# EAGLE design MRCS-MorseKOB_Sounder_Driver (EAGLE 7.7.0)
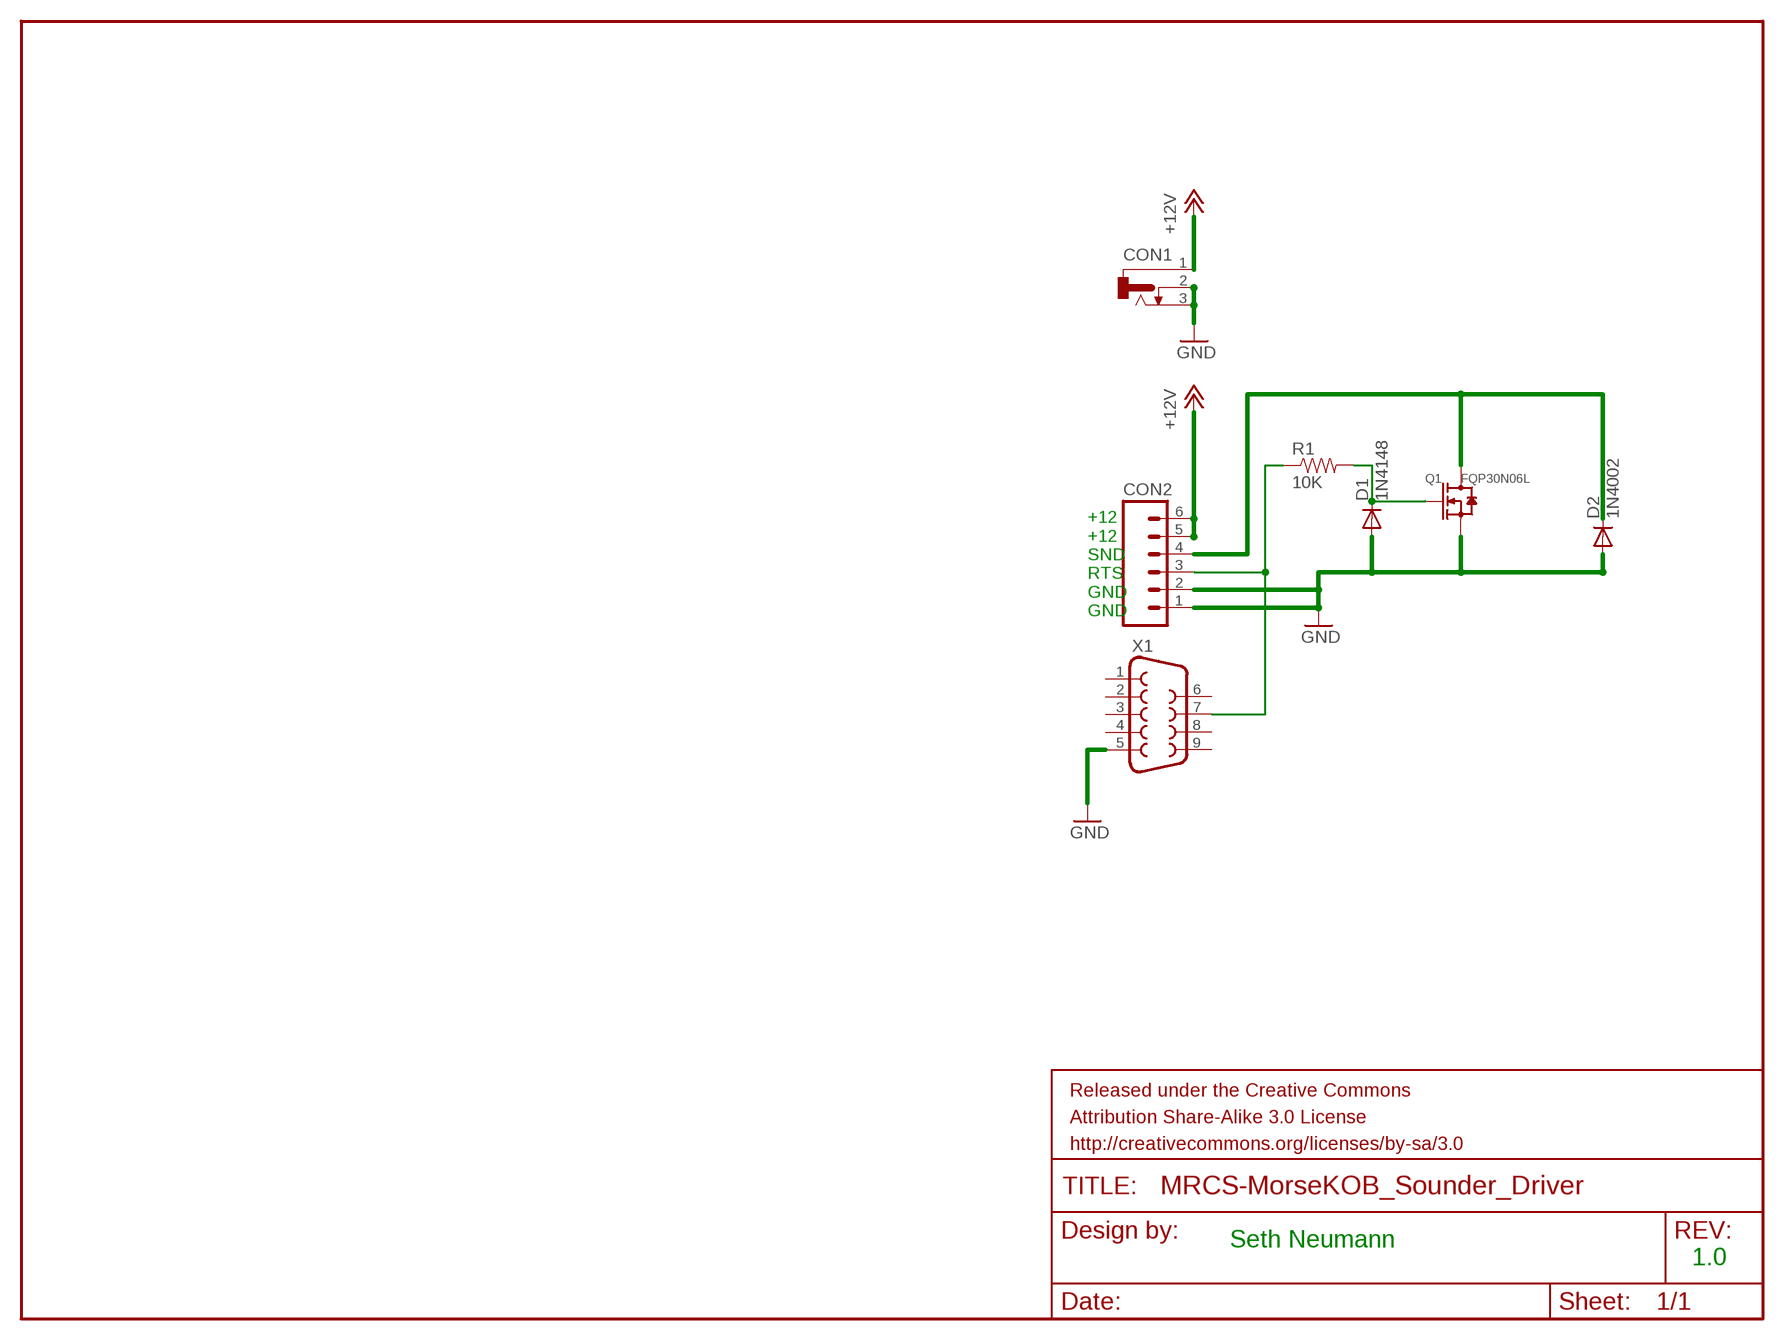
[diagram p0: schematic, sheet 1]

## Parts
CON1  CONNECTOR-DC-POWER-RA  [DCJ0202]
CON2  CONNECTOR-M063.5MM-6  [SCREWTERMINAL-3.5MM-6]
D1  1N4148  DIODE1N4148  [DIODE-1N4148]
D2  1N4002  DIODEPTH  [DIODE-1N4001]
FRAME1  FRAME-LETTER  [CREATIVE_COMMONS]
Q1  FQP30N06L  MOSFET-N--TO220V  [TO220V]
R1  10K  RPTH04  [AXIAL-0.4-RES]
X1  DB9FEMALE  [DB9]

## Nets
+12V: CON1.1 CON2.5 CON2.6
GND: CON1.2 CON1.3 CON2.1 CON2.2 D1.A D2.A Q1.3(S) X1.5
N$1: CON2.3 R1.P$1 X1.7
N$2: D1.C Q1.1(G) R1.P$2
N$3: CON2.4 D2.C Q1.2(D)
Unconnected: X1.1 X1.2 X1.3 X1.4 X1.6 X1.8 X1.9

## Notes on the sheet
- +12
  +12
  SND
  RTS
  GND
  GND
- Seth Neumann
- 1.0

## Library data of the parts
CON1 = SPCoast:CONNECTOR-DC-POWER: DC POWER JACK
CON2 = SPCoast:CONNECTOR-M06: Header 6 Standard 6-pin 0.1" header
D1 D2 = SPCoast:DIODE: Diode These are standard reverse protection diodes and small signal diodes. SMA package can handle up to about 1A. SOD-323 can handle about 200mA. What the SOD-323 package when ordering, there are some mfgs out there that are 5-pin packages.
FRAME1 = SparkFun-Aesthetics:FRAME-LETTER: Schematic Frame Standard 8.5x11 US Letter frame
Q1 = SPCoast:MOSFET-N-*-?: CJ2302：SMD MOSFET N-CH 20V-2.1A DMN4468 - SO8 30v/10A
R1 = SPCoast:R*: Resistor Basic schematic elements and footprints for 0603, 1206, and PTH 1/10th watt (small) resistors.
X1 = SparkFun-Connectors:DB9: DB9 Connector Standard DB9 (D-Sub 9) serial connector. Can be used for CAN bus as well as RS485 and RS232. Footprint production proven. Spark Fun Electronics SKU : PRT-00429

## Board
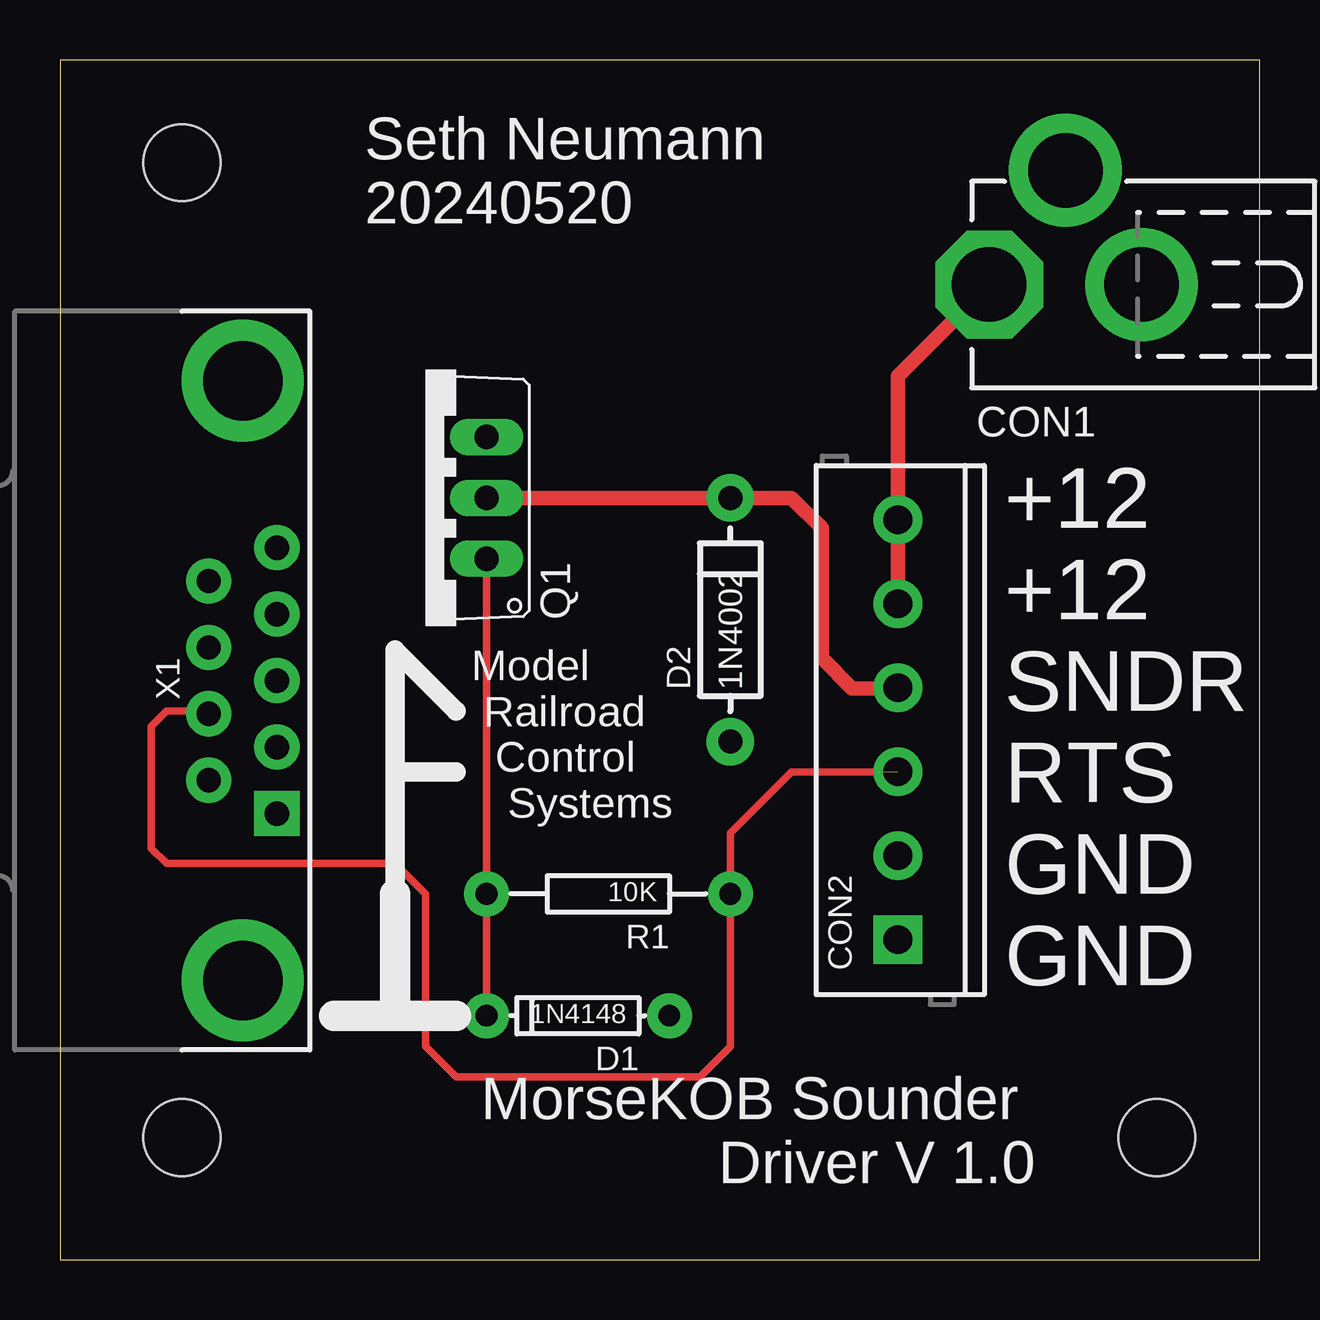
[diagram p1: board, top side]
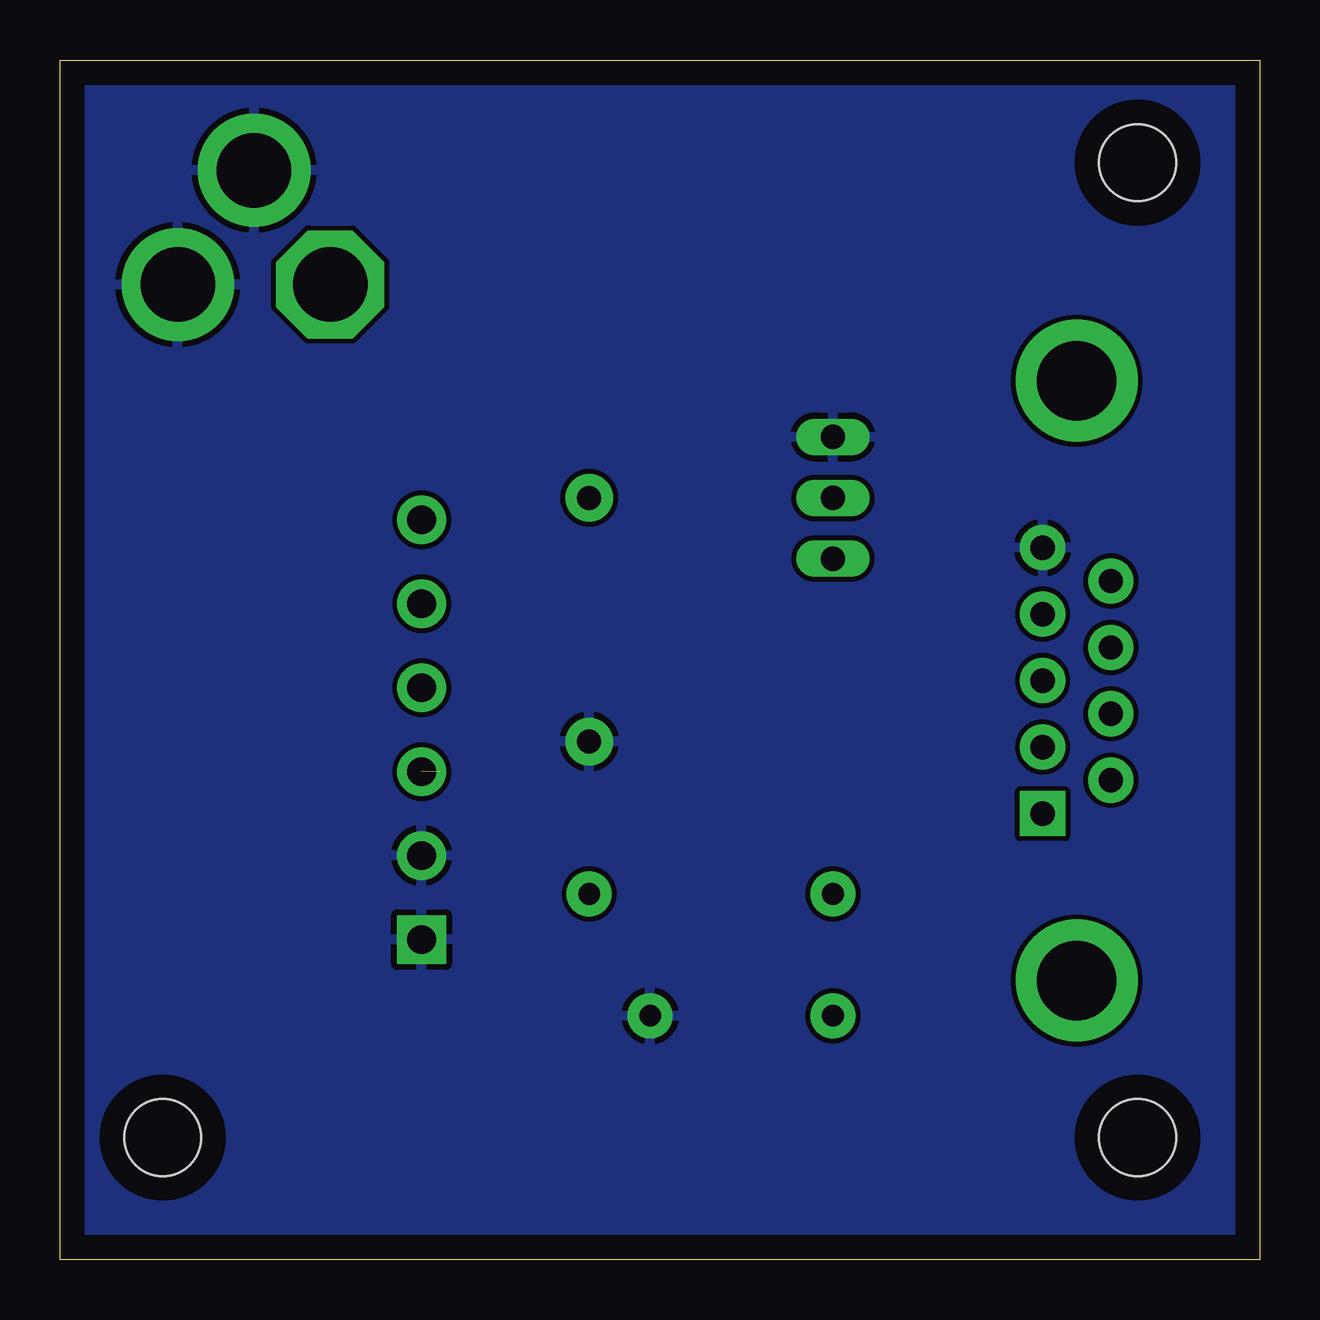
[diagram p2: board, bottom side, seen from below]

Size 50 x 50 mm. Coordinates in mm from the lower left corner, seen from the top.
Outline: 0,0 50,0 50,50 0,50 0,0
Copper layers (1*16): Top 0.035mm / dielectric 1.5mm / Bottom 0.035mm
Design rules "default": minimum track width 10mil, minimum drill 24mil, track to track 8mil, track to pad 8mil, pad to pad 8mil, via to via 8mil, smd to smd 8mil, copper to edge 40mil, drill to drill 8mil, minimum pad ring 10mil, minimum via ring 8mil, stop-mask expansion 4mil, vias tented up to drill 0mil, thermal gap 10mil
Holes 3.2 mm at 5.08,45.72 5.08,5.08 45.72,5.08

### Footprints (pad centres in the part's own frame; a part is rotated, then mirrored left to right if it is on the bottom)
DCJ0202 = drill 3.1 pad 4.5 octagon: 1 0,3.175 | drill 3.1 pad 4.7: 2 4.763,0; 3 0,-3.175
SCREWTERMINAL-3.5MM-6 = drill 1.2 pad 2.032 square: 1 0,0 | drill 1.2 pad 2.032: 2 3.5,0; 3 7,0; 4 10.5,0; 5 14,0; 6 17.5,0
DIODE-1N4148 = drill 0.9 pad 1.88: A 3.81,0; C -3.81,0
DIODE-1N4001 = drill 1 pad 1.981: A 5.08,0; C -5.08,0
TO220V = drill 1.016 long: 1 -2.54,-2.54; 2 0,-2.54; 3 2.54,-2.54
AXIAL-0.4-RES = drill 0.9 pad 1.88: P$1 -5.08,0; P$2 5.08,0
DB9 = drill 1.016 pad 1.88 square: 1 -5.54,-1.42 | drill 1.016 pad 1.88: 2 -2.77,-1.42; 3 0,-1.42; 4 2.77,-1.42; 5 5.54,-1.42; 6 -4.15,1.42; 7 -1.38,1.42; 8 1.38,1.42; 9 4.15,1.42 | drill 3.302 pad 5.08: G1 -12.5,0; G2 12.5,0

### Placement (x,y rotation side)
CON1  41.91,40.64 90 top
CON2  34.92,13.34 90 top
D1  21.59,10.16 0 top
D2  27.94,26.67 270 top
FRAME1  3.81,-21.59 0 top  (outside the outline)
Q1  15.24,31.75 90 top
R1  22.86,15.24 180 top
U$1  [MRCS-LOGO]  13.97,10.16 0 top
U$2  [CA-PROP65WARNING]  27.94,40.64 0 top
X1  7.62,24.13 90 top

### Tracks (layer width: path | path; a pad name or v marks a point on that pad's centre or on a via)
+12V
  Top 0.61: CON2.5 CON2.6 34.92,36.83 CON1.1
GND
  pour Bottom: 0,0 49.53,0 49.53,49.53 0,49.53
N$1  (1 unrouted)
  Top 0.305: 34.16,20.32 30.48,20.32 27.94,17.78 R1.P$1 27.94,8.89 26.67,7.62 16.51,7.62 15.24,8.89 15.24,15.24 13.97,16.51 4.45,16.51 3.81,17.14 3.81,22.23 4.45,22.86 6.09,22.86 X1.7
N$2
  Top 0.305: D1.C R1.P$2 Q1.1
N$3
  Top 0.61: Q1.2 D2.C 30.48,31.75 31.75,30.48 31.75,25.08 33.02,23.81 34.9,23.81 CON2.4

### Text on the board
tNames: Seth Neumann / 20240520 | +12 / +12 / SNDR / RTS / GND / GND | MorseKOB Sounder / Driver V 1.0